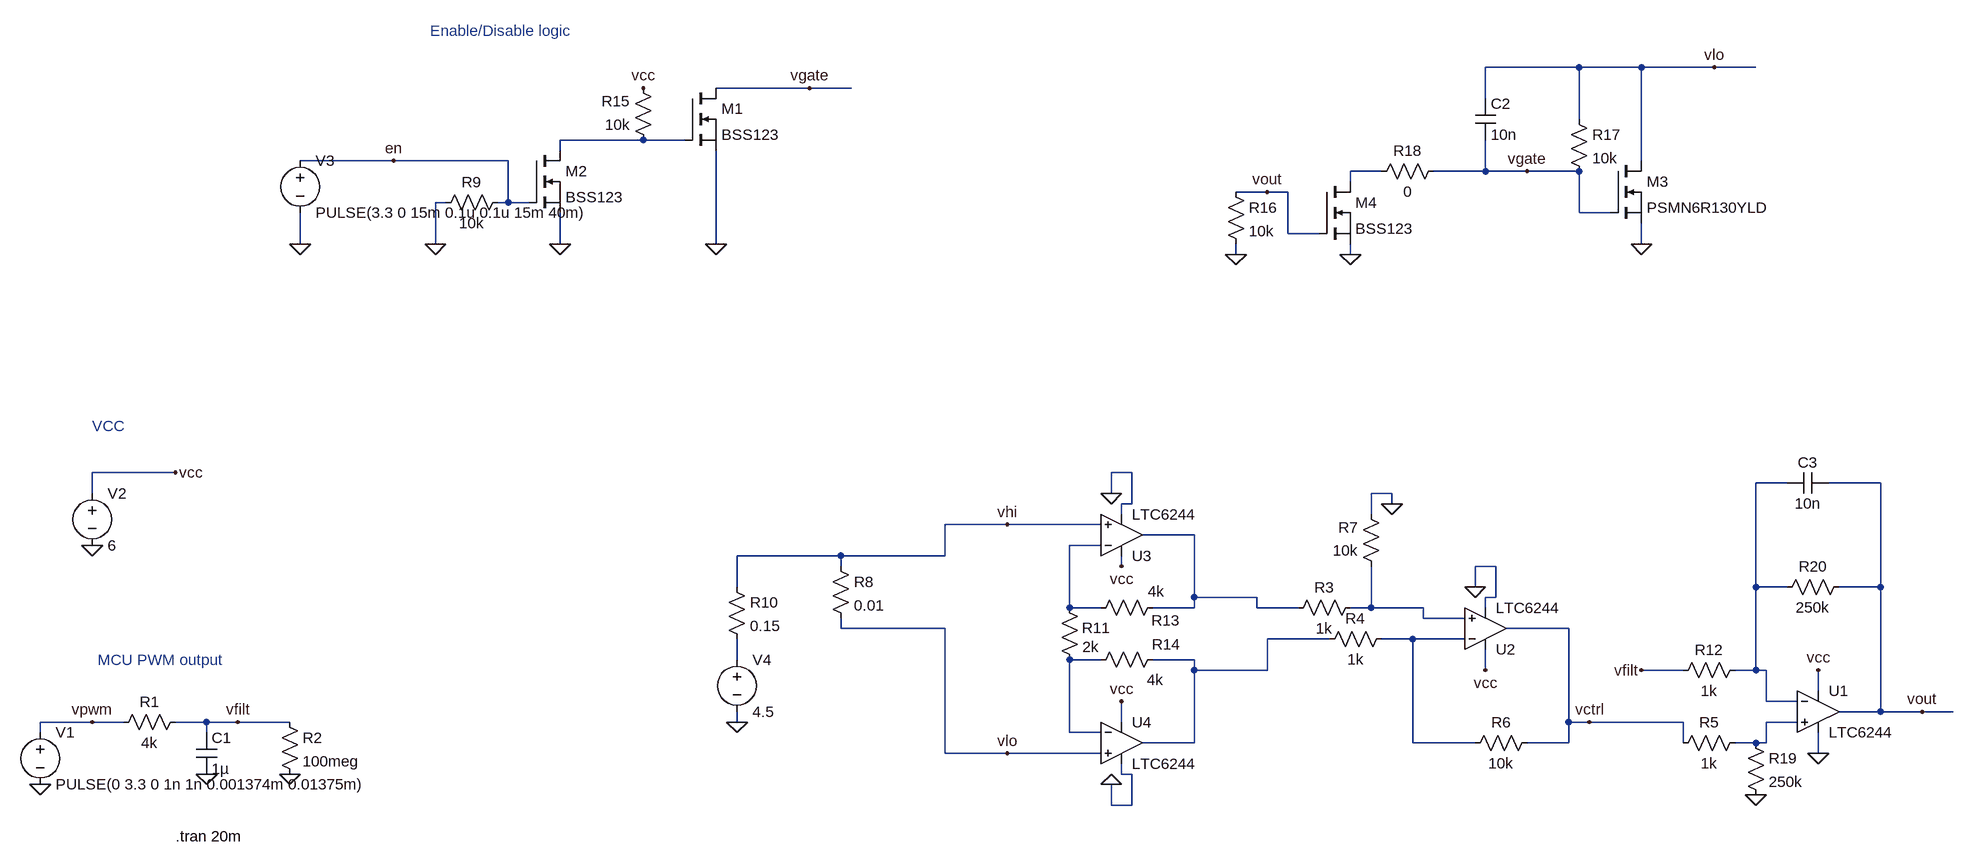
[diagram p0: schematic dchrg_ilim_modding.asc]
dchrg_ilim_modding.asc, the LTspice schematic file:
Version 4
SHEET 1 2260 844
WIRE 1600 -912 1456 -912
WIRE 1696 -912 1600 -912
WIRE 1808 -912 1696 -912
WIRE 1872 -912 1808 -912
WIRE 416 -880 272 -880
WIRE 480 -880 416 -880
WIRE 1456 -864 1456 -912
WIRE 1600 -832 1600 -912
WIRE 160 -800 32 -800
WIRE 224 -800 160 -800
WIRE 32 -784 32 -800
WIRE -224 -768 -368 -768
WIRE -48 -768 -224 -768
WIRE 1696 -768 1696 -912
WIRE 1296 -752 1248 -752
WIRE 1456 -752 1456 -800
WIRE 1456 -752 1376 -752
WIRE 1520 -752 1456 -752
WIRE 1600 -752 1520 -752
WIRE 1248 -736 1248 -752
WIRE 1120 -720 1072 -720
WIRE 1152 -720 1120 -720
WIRE -144 -704 -160 -704
WIRE -48 -704 -48 -768
WIRE -48 -704 -64 -704
WIRE -16 -704 -48 -704
WIRE 1600 -688 1600 -752
WIRE 1648 -688 1600 -688
WIRE 1152 -656 1152 -720
WIRE 1200 -656 1152 -656
WIRE -368 -640 -368 -688
WIRE -160 -640 -160 -704
WIRE 32 -640 32 -688
WIRE 272 -640 272 -784
WIRE 1696 -640 1696 -672
WIRE 1072 -624 1072 -640
WIRE 1248 -624 1248 -640
WIRE -560 -288 -688 -288
WIRE 912 -288 880 -288
WIRE 1920 -272 1872 -272
WIRE 2064 -272 1984 -272
WIRE -688 -256 -688 -288
WIRE 880 -256 880 -288
WIRE 1312 -256 1280 -256
WIRE 912 -240 912 -288
WIRE 912 -240 896 -240
WIRE 1312 -240 1312 -256
WIRE 896 -224 896 -240
WIRE 1280 -224 1280 -256
WIRE 720 -208 624 -208
WIRE 864 -208 720 -208
WIRE 1008 -192 928 -192
WIRE 864 -176 816 -176
WIRE 464 -160 304 -160
WIRE 624 -160 624 -208
WIRE 624 -160 464 -160
WIRE 464 -144 464 -160
WIRE 896 -144 896 -160
WIRE 1472 -144 1440 -144
WIRE 304 -112 304 -160
WIRE 1440 -112 1440 -144
WIRE 1872 -112 1872 -272
WIRE 1920 -112 1872 -112
WIRE 2064 -112 2064 -272
WIRE 2064 -112 2000 -112
WIRE 1008 -96 1008 -192
WIRE 1104 -96 1008 -96
WIRE 1472 -96 1472 -144
WIRE 1472 -96 1456 -96
WIRE 816 -80 816 -176
WIRE 864 -80 816 -80
WIRE 1008 -80 1008 -96
WIRE 1008 -80 944 -80
WIRE 1104 -80 1104 -96
WIRE 1168 -80 1104 -80
WIRE 1280 -80 1280 -144
WIRE 1280 -80 1248 -80
WIRE 1360 -80 1280 -80
WIRE 1456 -80 1456 -96
WIRE 1360 -64 1360 -80
WIRE 1424 -64 1360 -64
WIRE 464 -48 464 -64
WIRE 624 -48 464 -48
WIRE 1584 -48 1488 -48
WIRE 1216 -32 1120 -32
WIRE 1344 -32 1296 -32
WIRE 1424 -32 1344 -32
WIRE 304 0 304 -32
WIRE 864 0 816 0
WIRE 1008 0 944 0
WIRE 1008 16 1008 0
WIRE 1120 16 1120 -32
WIRE 1120 16 1008 16
WIRE 1456 16 1456 -16
WIRE 1760 16 1696 16
WIRE 1872 16 1872 -112
WIRE 1872 16 1840 16
WIRE 1888 16 1872 16
WIRE 1968 48 1968 16
WIRE 1888 64 1888 16
WIRE 1936 64 1888 64
WIRE 2064 80 2064 -112
WIRE 2064 80 2000 80
WIRE 2128 80 2064 80
WIRE 2176 80 2128 80
WIRE -688 96 -768 96
WIRE -640 96 -688 96
WIRE -512 96 -560 96
WIRE -464 96 -512 96
WIRE -384 96 -464 96
WIRE 304 96 304 80
WIRE 896 96 896 64
WIRE 1584 96 1584 -48
WIRE 1616 96 1584 96
WIRE 1760 96 1616 96
WIRE 1936 96 1888 96
WIRE -768 112 -768 96
WIRE -512 112 -512 96
WIRE 816 112 816 0
WIRE 864 112 816 112
WIRE 1008 128 1008 16
WIRE 1008 128 928 128
WIRE 1344 128 1344 -32
WIRE 1440 128 1344 128
WIRE 1584 128 1584 96
WIRE 1584 128 1520 128
WIRE 1760 128 1760 96
WIRE 1872 128 1840 128
WIRE 1888 128 1888 96
WIRE 1888 128 1872 128
WIRE 624 144 624 -48
WIRE 720 144 624 144
WIRE 864 144 720 144
WIRE 1968 144 1968 112
WIRE 896 176 896 160
WIRE 912 176 896 176
WIRE 880 224 880 192
WIRE 912 224 912 176
WIRE 912 224 880 224
FLAG -768 192 0
FLAG -512 176 0
FLAG -384 176 0
FLAG -688 96 vpwm
FLAG -464 96 vfilt
FLAG -688 -176 0
FLAG -560 -288 vcc
FLAG 1456 16 vcc
FLAG 1968 16 vcc
FLAG 1440 -112 0
FLAG 1968 144 0
FLAG 1696 16 vfilt
FLAG 720 -208 vhi
FLAG 1616 96 vctrl
FLAG 2128 80 vout
FLAG 1312 -240 0
FLAG 720 144 vlo
FLAG 896 -144 vcc
FLAG 880 -256 0
FLAG 896 64 vcc
FLAG 880 192 0
FLAG 32 -640 0
FLAG 272 -640 0
FLAG -160 -640 0
FLAG -224 -768 en
FLAG 416 -880 vgate
FLAG -368 -640 0
FLAG 1696 -640 0
FLAG 1248 -624 0
FLAG 1072 -624 0
FLAG 1120 -720 vout
FLAG 1808 -912 vlo
FLAG 304 96 0
FLAG 1520 -752 vgate
FLAG 1872 208 0
FLAG 160 -880 vcc
SYMBOL voltage -768 96 R0
WINDOW 123 0 0 Left 2
WINDOW 39 0 0 Left 2
SYMATTR InstName V1
SYMATTR Value PULSE(0 3.3 0 1n 1n 0.001374m 0.01375m)
SYMBOL res -544 80 R90
WINDOW 0 0 56 VBottom 2
WINDOW 3 32 56 VTop 2
SYMATTR InstName R1
SYMATTR Value 4k
SYMBOL cap -528 112 R0
SYMATTR InstName C1
SYMATTR Value 1µ
SYMBOL res -400 80 R0
SYMATTR InstName R2
SYMATTR Value 100meg
SYMBOL Opamps\\LTC6244 1968 80 R0
SYMATTR InstName U1
SYMBOL Opamps\\LTC6244 1456 -48 M180
SYMATTR InstName U2
SYMBOL voltage -688 -272 R0
WINDOW 123 0 0 Left 2
WINDOW 39 0 0 Left 2
SYMATTR InstName V2
SYMATTR Value 6
SYMBOL res 1264 -96 R90
WINDOW 0 0 56 VBottom 2
WINDOW 3 32 56 VTop 2
SYMATTR InstName R3
SYMATTR Value 1k
SYMBOL res 1312 -48 R90
WINDOW 0 0 56 VBottom 2
WINDOW 3 32 56 VTop 2
SYMATTR InstName R4
SYMATTR Value 1k
SYMBOL res 1536 112 R90
WINDOW 0 0 56 VBottom 2
WINDOW 3 32 56 VTop 2
SYMATTR InstName R6
SYMATTR Value 10k
SYMBOL res 1296 -128 R180
WINDOW 0 36 76 Left 2
WINDOW 3 36 40 Left 2
SYMATTR InstName R7
SYMATTR Value 10k
SYMBOL res 448 -160 R0
SYMATTR InstName R8
SYMATTR Value 0.01
SYMBOL Opamps\\LTC6244 896 -192 M180
SYMATTR InstName U3
SYMBOL Opamps\\LTC6244 896 128 R0
SYMATTR InstName U4
SYMBOL res 800 -96 R0
WINDOW 0 35 47 Left 2
SYMATTR InstName R11
SYMATTR Value 2k
SYMBOL res 960 -96 R90
WINDOW 0 51 -4 VBottom 2
WINDOW 3 -25 11 VTop 2
SYMATTR InstName R13
SYMATTR Value 4k
SYMBOL res 960 -16 R90
WINDOW 0 8 -5 VBottom 2
WINDOW 3 31 12 VTop 2
SYMATTR InstName R14
SYMATTR Value 4k
SYMBOL nmos 224 -880 R0
SYMATTR InstName M1
SYMATTR Value BSS123
SYMBOL nmos -16 -784 R0
SYMATTR InstName M2
SYMATTR Value BSS123
SYMBOL res -48 -720 R90
WINDOW 0 0 56 VBottom 2
WINDOW 3 32 56 VTop 2
SYMATTR InstName R9
SYMATTR Value 10k
SYMBOL res 176 -784 R180
WINDOW 0 36 76 Left 2
WINDOW 3 36 40 Left 2
SYMATTR InstName R15
SYMATTR Value 10k
SYMBOL voltage -368 -784 R0
WINDOW 123 0 0 Left 2
WINDOW 39 0 0 Left 2
SYMATTR InstName V3
SYMATTR Value PULSE(3.3 0 15m 0.1u 0.1u 15m 40m)
SYMBOL nmos 1648 -768 R0
SYMATTR InstName M3
SYMATTR Value PSMN6R130YLD
SYMBOL nmos 1200 -736 R0
SYMATTR InstName M4
SYMATTR Value BSS123
SYMBOL res 1056 -736 R0
SYMATTR InstName R16
SYMATTR Value 10k
SYMBOL res 1584 -848 R0
SYMATTR InstName R17
SYMATTR Value 10k
SYMBOL res 288 -128 R0
SYMATTR InstName R10
SYMATTR Value 0.15
SYMBOL voltage 304 -16 R0
WINDOW 123 0 0 Left 2
WINDOW 39 0 0 Left 2
SYMATTR InstName V4
SYMATTR Value 4.5
SYMBOL res 1392 -768 R90
WINDOW 0 0 56 VBottom 2
WINDOW 3 32 56 VTop 2
SYMATTR InstName R18
SYMATTR Value 0
SYMBOL cap 1440 -864 R0
SYMATTR InstName C2
SYMATTR Value 10n
SYMBOL res 1856 112 R90
WINDOW 0 0 56 VBottom 2
WINDOW 3 32 56 VTop 2
SYMATTR InstName R5
SYMATTR Value 1k
SYMBOL res 1856 0 R90
WINDOW 0 0 56 VBottom 2
WINDOW 3 32 56 VTop 2
SYMATTR InstName R12
SYMATTR Value 1k
SYMBOL res 1856 112 R0
SYMATTR InstName R19
SYMATTR Value 250k
SYMBOL res 2016 -128 R90
WINDOW 0 0 56 VBottom 2
WINDOW 3 32 56 VTop 2
SYMATTR InstName R20
SYMATTR Value 250k
SYMBOL cap 1984 -288 R90
WINDOW 0 0 32 VBottom 2
WINDOW 3 32 32 VTop 2
SYMATTR InstName C3
SYMATTR Value 10n
TEXT -560 272 Left 2 !.tran 20m
TEXT -168 -968 Left 2 ;Enable/Disable logic
TEXT -688 -360 Left 2 ;VCC
TEXT -680 0 Left 2 ;MCU PWM output

The netlist it stands for:
* dchrg_ilim_modding.asc
V1 vpwm 0 PULSE(0 3.3 0 1n 1n 0.001374m 0.01375m)
R1 vfilt vpwm 4k
C1 vfilt 0 1µ
R2 vfilt 0 100meg
XU1 N011 N003 vcc 0 vout LTC6244  ; pins In+ In- V+ V- OUT
XU2 N006 N008 vcc 0 vctrl LTC6244  ; pins In+ In- V+ V- OUT
V2 vcc 0 6
R3 N006 N004 1k
R4 N008 N007 1k
R6 vctrl N008 10k
R7 N006 0 10k
R8 vhi vlo 0.01
XU3 vhi N005 vcc 0 N004 LTC6244  ; pins In+ In- V+ V- OUT
XU4 vlo N010 vcc 0 N007 LTC6244  ; pins In+ In- V+ V- OUT
R11 N005 N010 2k
R13 N004 N005 4k
R14 N007 N010 4k
M1 vgate N001 0 0 BSS123
M2 N001 en 0 0 BSS123
R9 en 0 10k
R15 N001 vcc 10k
V3 en 0 PULSE(3.3 0 15m 0.1u 0.1u 15m 40m)
M3 vlo vgate 0 0 PSMN6R130YLD
M4 N002 vout 0 0 BSS123
R16 vout 0 10k
R17 vlo vgate 10k
R10 vhi N009 0.15
V4 N009 0 4.5
R18 vgate N002 0
C2 vlo vgate 10n
R5 N011 vctrl 1k
R12 N003 vfilt 1k
R19 N011 0 250k
R20 vout N003 250k
C3 vout N003 10n
.model NMOS NMOS
.model PMOS PMOS
.lib standard.mos
.tran 20m
* Enable/Disable logic
* VCC
* MCU PWM output
.backanno
.end